# Altium schematic sheet mct5.SchDoc
size A4
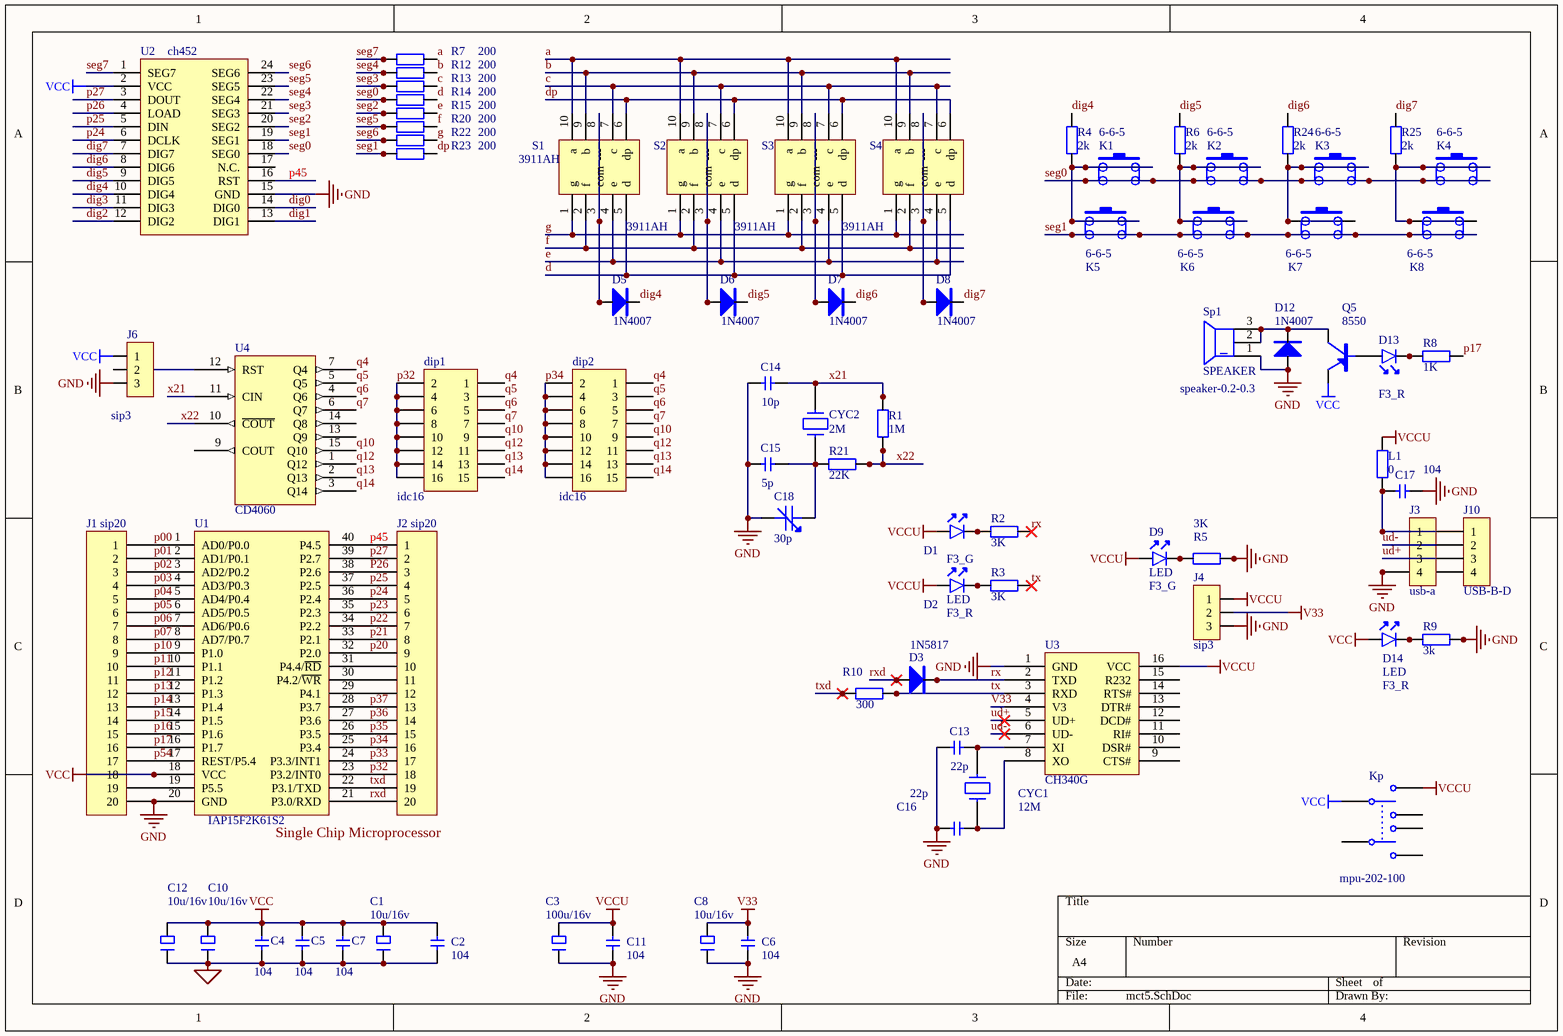
[diagram p0: mct5.SchDoc]

## Parts
C1  10u/16v  [rb.1/.2]
C2  104  [cap0.1]
C3  value 100u/16v  [rb.1/.2]  (hidden comment: 10u/16v)
C4  104  [cap0.1]
C5  104  [cap0.1]
C6  104  [cap0.1]
C7  104  [cap0.1]
C8  10u/16v  [rb.1/.2]
C10  10u/16v  [rb.1/.2]
C11  104  [cap0.1]
C12  10u/16v  [rb.1/.2]
C13  value 22p  [cap010805]  (hidden comment: 104)
C14  value 10p  [cap0.1]  (hidden comment: CAP)
C15  5p  [cap0.1]
C16  value 22p  [cap010805]
C17  104  [cap010805]
C18  30p  [sr2-c]
CYC1  value 12M  [cyc-rad]  (hidden comment: 12Mhz)
CYC2  2M  [cyc-rad]
D1  value F3_G  [led30805]  (hidden comment: LED)
D2  LED  value F3_R  [led30805]
D3  value 1N5817  [smc03]  (hidden comment: sma03)
D5  value 1N4007  [smc03]  (hidden comment: sma03)
D6  value 1N4007  [smc03]  (hidden comment: sma03)
D7  value 1N4007  [smc03]  (hidden comment: sma03)
D8  value 1N4007  [smc03]  (hidden comment: sma03)
D9  LED  value F3_G  [led30805]
D12  value 1N4007  [smc03]  (hidden comment: sma03)
D13  value F3_R  [led-3]  (hidden comment: LED)
D14  LED  value F3_R  [led-3]
dip1  value idc16  [HDR2X8]  (hidden comment: Header 8X2)
dip2  value idc16  [HDR2X8]  (hidden comment: Header 8X2)
J1  value sip20  [HDR1X20]  (hidden comment: Header 20)
J2  value sip20  [HDR1X20]  (hidden comment: Header 20)
J3  USB-a  [usb-a]
J4  value sip3  [SIP3]  (hidden comment: Header 20)
J6  value sip3  [sip3]  (hidden comment: CON3)
J10  value USB-B-D  [USB_b]
K1  6-6-5  [pb6_6]
K2  6-6-5  [pb6_6]
K3  6-6-5  [pb6_6]
K4  6-6-5  [pb6_6]
K5  6-6-5  [pb6_6]
K6  6-6-5  [pb6_6]
K7  6-6-5  [pb6_6]
K8  6-6-5  [pb6_6]
Kp  value mpu-202-100  [DPDT-6]  (hidden comment: SW-DPDT)
L1  value 0  [axial0.3]  (hidden comment: Res2)
Q5  8550  [to-92a]
R1  value 1M  [a030805]  (hidden comment: Res22)
R2  value 3K  [a030805]  (hidden comment: Res2)
R3  value 3K  [a030805]  (hidden comment: Res2)
R4  value 2k  [a030805]  (hidden comment: Res22)
R5  value 3K  [a030805]  (hidden comment: Res2)
R6  value 2k  [a030805]  (hidden comment: Res22)
R7  value 200  [a030805]  (hidden comment: Res22)
R8  value 1K  [a030805]  (hidden comment: Res22)
R9  value 3k  [a030805]  (hidden comment: Res22)
R10  value 300  [a030805]  (hidden comment: Res2)
R12  value 200  [a030805]  (hidden comment: Res22)
R13  value 200  [a030805]  (hidden comment: Res22)
R14  value 200  [a030805]  (hidden comment: Res22)
R15  value 200  [a030805]  (hidden comment: Res22)
R20  value 200  [a030805]  (hidden comment: Res22)
R21  value 22K  [a030805]  (hidden comment: Res22)
R22  value 200  [a030805]  (hidden comment: Res22)
R23  value 200  [a030805]  (hidden comment: Res22)
R24  value 2k  [a030805]  (hidden comment: Res22)
R25  value 2k  [a030805]  (hidden comment: Res22)
S1  3911AH  [LED10s]
S2  3911AH  [LED10s]
S3  3911AH  [LED10s]
S4  3911AH  [LED10s]
Sp1  SPEAKER  value speaker-0.2-0.3  [sp0.23]
U1  IAP15F2K61S2  [DIP40]
U2  value ch452  [dip24]  (hidden comment: CH451)
U3  CH340G  [SOP-16]
U4  value CD4060  [dip16]  (hidden comment: 4060)

## Nets
GND: C1.1 C2.2 C3.1 C4.2 C5.2 C6.2 C7.2 C8.1 C10.1 C11.2 C12.1 C13.2 C14.2 C15.2 C16.2 C17.2 C18.2 D12.2 D12.4 J1.20 J3.4 J4.3 J6.3 J10.4 R5.1 R5.3 R9.1 R9.3 Sp1.1 U1.20(GND) U2.15(GND) U3.1(GND) U4.8(GND)
V33: C6.1 C8.2 J4.2 U3.4(V3)
VCC: C1.2 C2.1 C4.1 C5.1 C7.1 C10.2 C12.2 D14.1 J1.18 J6.1 Kp.2 Q5.1(E) U1.18(VCC) U2.2(VCC) U4.16(VCC)
VCCU: C3.2 C11.1 D1.1 D2.1 D9.1 J4.1 Kp.1 L1.2 U3.16(VCC)
a: R7.2 R7.4 S1.10(a) S2.10(a) S3.10(a) S4.10(a)
b: R12.2 R12.4 S1.9(b) S2.9(b) S3.9(b) S4.9(b)
c: R13.2 R13.4 S1.7(c) S2.7(c) S3.7(c) S4.7(c)
d: R14.2 R14.4 S1.5(d) S2.5(d) S3.5(d) S4.5(d)
dig0: U2.14(DIG0)
dig1: U2.13(DIG1)
dig2: U2.12(DIG2)
dig3: U2.11(DIG3)
dig4: D5.1 D5.3 R4.1 R4.3 U2.10(DIG4)
dig5: D6.1 D6.3 R6.1 R6.3 U2.9(DIG5)
dig6: D7.1 D7.3 R24.1 R24.3 U2.8(DIG6)
dig7: D8.1 D8.3 R25.1 R25.3 U2.7(DIG7)
dp: R23.2 R23.4 S1.6(dp) S2.6(dp) S3.6(dp) S4.6(dp)
e: R15.2 R15.4 S1.4(e) S2.4(e) S3.4(e) S4.4(e)
f: R20.2 R20.4 S1.2(f) S2.2(f) S3.2(f) S4.2(f)
g: R22.2 R22.4 S1.1(g) S2.1(g) S3.1(g) S4.1(g)
p00: J1.1 U1.1(AD0/P0.0)
p01: J1.2 U1.2(AD1/P0.1)
p02: J1.3 U1.3(AD2/P0.2)
p03: J1.4 U1.4(AD3/P0.3)
p04: J1.5 U1.5(AD4/P0.4)
p05: J1.6 U1.6(AD5/P0.5)
p06: J1.7 U1.7(AD6/P0.6)
p07: J1.8 U1.8(AD7/P0.7)
p10: J1.9 U1.9(P1.0)
p11: J1.10 U1.10(P1.1)
p12: J1.11 U1.11(P1.2)
p13: J1.12 U1.12(P1.3)
p14: J1.13 U1.13(P1.4)
p15: J1.14 U1.14(P1.5)
p16: J1.15 U1.15(P1.6)
p17: J1.16 R8.2 R8.4 U1.16(P1.7)
p20: J2.9 U1.32(P2.0)
p21: J2.8 U1.33(P2.1)
p22: J2.7 U1.34(P2.2)
p23: J2.6 U1.35(P2.3)
p24: J2.5 U1.36(P2.4) U2.6(DCLK)
p25: J2.4 U1.37(P2.5) U2.5(DIN)
P26: J2.3 U1.38(P2.6) U2.4(LOAD)
p27: J2.2 U1.39(P2.7) U2.3(DOUT)
p32: dip1.2 dip1.4 dip1.6 dip1.8 dip1.10 dip1.12 dip1.14 dip1.16 J2.18 U1.23(P3.2/INT0)
p33: J2.17 U1.24(P3.3/INT1)
p34: dip2.2 dip2.4 dip2.6 dip2.8 dip2.10 dip2.12 dip2.14 dip2.16 J2.16 U1.25(P3.4)
p35: J2.15 U1.26(P3.5)
p36: J2.14 U1.27(P3.6)
p37: J2.13 U1.28(P3.7)
p45: J2.1 U1.40(P4.5) U2.16(RST)
p54: J1.17 U1.17(REST/P5.4)
q4: dip1.1 dip2.1 U4.7(Q4)
q5: dip1.3 dip2.3 U4.5(Q5)
q6: dip1.5 dip2.5 U4.4(Q6)
q7: dip1.7 dip2.7 U4.6(Q7)
q10: dip1.9 dip2.9 U4.15(Q10)
q12: dip1.11 dip2.11 U4.1(Q12)
q13: dip1.13 dip2.13 U4.2(Q13)
q14: dip1.15 dip2.15 U4.3(Q14)
rx: D3.1 D3.3 R2.1 R2.3 U3.2(TXD)
rxd: D3.2 D3.4 J2.20 U1.21(P3.0/RXD)
seg0: K1.2 K1.3 K2.2 K2.3 K3.2 K3.3 K4.2 K4.3 R14.1 R14.3 U2.18(SEG0)
seg1: K5.2 K5.3 K6.2 K6.3 K7.2 K7.3 K8.2 K8.3 R23.1 R23.3 U2.19(SEG1)
seg2: R15.1 R15.3 U2.20(SEG2)
seg3: R13.1 R13.3 U2.21(SEG3)
seg4: R12.1 R12.3 U2.22(SEG4)
seg5: R20.1 R20.3 U2.23(SEG5)
seg6: R22.1 R22.3 U2.24(SEG6)
seg7: R7.1 R7.3 U2.1(SEG7)
tx: R3.1 R3.3 R10.1 R10.3 U3.3(RXD)
txd: J2.19 R10.2 R10.4 U1.22(P3.1/TXD)
ud+: J3.3 J10.3 U3.5(UD+)
ud-: J3.2 J10.2 U3.6(UD-)
x21: C14.1 CYC2.2 R1.2 R1.4 U4.11(CIN)
x22: R1.1 R1.3 R21.2 R21.4 U4.10(~{COUT})
NetC13_1: C13.1 CYC1.2 U3.7(XI)
NetC15_1: C15.1 C18.1 CYC2.1 R21.1 R21.3
NetC16_1: C16.1 CYC1.1 U3.8(XO)
NetC17_1: C17.1 J3.1 J10.1 L1.1
NetD1_2: D1.2 R2.2 R2.4
NetD2_2: D2.2 R3.2 R3.4
NetD5_2: D5.2 D5.4 S1.3(com) S1.8(---)
NetD6_2: D6.2 D6.4 S2.3(com) S2.8(---)
NetD7_2: D7.2 D7.4 S3.3(com) S3.8(---)
NetD8_2: D8.2 D8.4 S4.3(com) S4.8(---)
NetD9_2: D9.2 R5.2 R5.4
NetD12_1: D12.1 D12.3 Q5.3(C) Sp1.2 Sp1.3
NetD13_1: D13.1 Q5.2(B)
NetD13_2: D13.2 R8.1 R8.3
NetD14_2: D14.2 R9.2 R9.4
NetJ1_19: J1.19 U1.19(P5.5)
NetJ2_10: J2.10 U1.31(P4.4/~{RD})
NetJ2_11: J2.11 U1.30(P4.2/~{WR})
NetJ2_12: J2.12 U1.29(P4.1)
NetJ6_2: J6.2 U4.12(RST)
NetK1_1: K1.1 K1.4 K5.1 K5.4 R4.2 R4.4
NetK2_1: K2.1 K2.4 K6.1 K6.4 R6.2 R6.4
NetK3_1: K3.1 K3.4 K7.1 K7.4 R24.2 R24.4
NetK4_1: K4.1 K4.4 K8.1 K8.4 R25.2 R25.4

Not connected (* = marked no-connect by the designer): Kp 3 4 5 6; U2 17(N.C.); U3 9(CTS#) 10(DSR#) 11(RI#) 12(DCD#) 13(DTR#) 14(RTS#) 15(R232); U4 9(COUT) 13(Q9) 14(Q8)

## Notes on the sheet
- Single Chip Microprocessor

## Library data of the parts
C1 C3 C8 C10 C12 = ELECTRO1: Electrolytic Capacitor
  C1 C8 C10 C12: Value: 10u/16v
C2 C4-C7 C11 C14 C15 C17 = CAP: Capacitor
  C2 C4-C7 C11 C17: Value: 104
  C15: Value: 5p
C13 C16 = CAP
C18 = CAPVAR: Variable Capacitor; Value: 30p
CYC1 CYC2 = CRYSTAL
  CYC2: Value: 2M
dip1 dip2 = Header 8X2: Header, 8-Pin, Dual row; LatestRevisionDate: 17-Jul-2002; LatestRevisionNote: Re-released for DXP Platform.; Publisher: Altium Limited
J1 J2 = Header 20: Header, 20-Pin; LatestRevisionDate: 17-Jul-2002; LatestRevisionNote: Re-released for DXP Platform.; Publisher: Altium Limited
J3 J10 = CON4: Connector
  J3: Value: usb-a
J4 J6 = CON3: Connector
K1-K8 = SW-PB2: Value: 6-6-5
Kp = SW-DPDT: Double-Pole, Double-Throw Switch; Published: 24-Mar-1999; LatestRevisionDate: 17-Jul-2002; LatestRevisionNote: Re-released for DXP Platform.; PackageReference: DPDT-6; Publisher: Altium Limited
L1 = Res2: Resistor; Published: 8-Jun-2000; LatestRevisionDate: 17-Jul-2002; LatestRevisionNote: Re-released for DXP Platform.; PackageReference: AXIAL-0.4; Publisher: Altium Limited
Q5 = PNP: Value: 8550
R1-R10 R12-R15 R20-R25 = Res22: Resistor; Published: 8-Jun-2000; LatestRevisionDate: 17-Jul-2002; LatestRevisionNote: Re-released for DXP Platform.; PackageReference: AXIAL-0.4; Publisher: Altium Limited
S1-S4 = DS1: Value: 3911AH
Sp1 = SPEAKER: SPEAKER sip0.2/0.3
U1 = Component_3: Value: IAP15F2K61S2